# EAGLE design arpie_cv_tab (EAGLE 6.6.0)
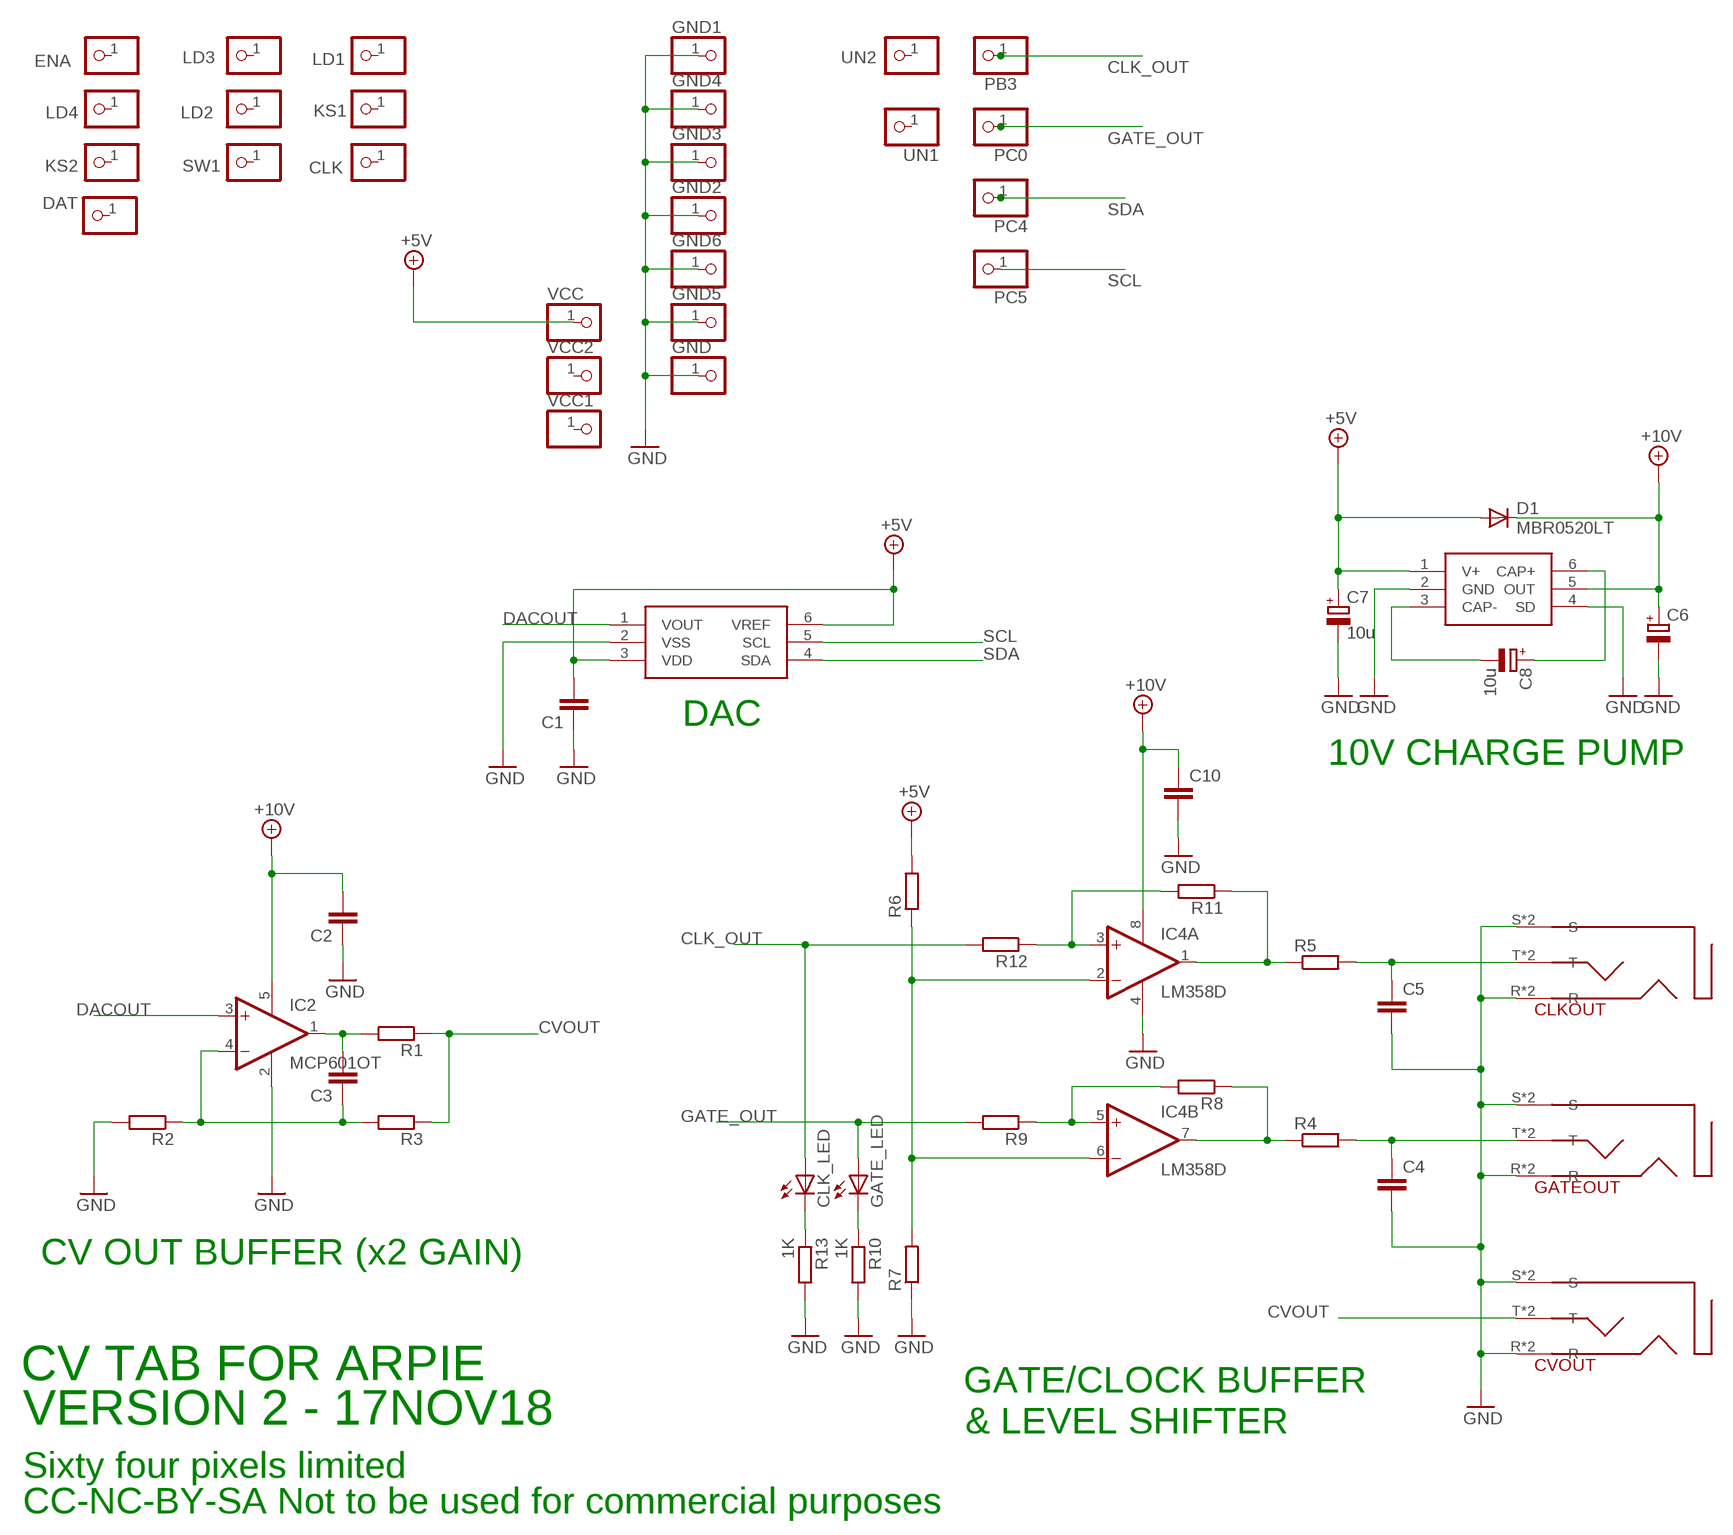
[diagram p0: schematic, sheet 1]

## Parts
C1  C-EUC0805  [C0805]
C2  C-EUC0805  [C0805]
C3  C-EUC0805  [C0805]
C4  C-EUC0805  [C0805]
C5  C-EUC0805  [C0805]
C6  CPOL-EUSMCA  [SMC_A]
C7  10u  CPOL-EUSMCA  [SMC_A]
C8  10u  CPOL-EUSMCA  [SMC_A]
C10  C-EUC0805  [C0805]
CLK  PINHD-1X1  [1X01]
CLK_LED  LED3MM  [LED3MM]
CLKOUT  SMD35MMJACK  [SMD35MMJACK]
CVOUT  SMD35MMJACK  [SMD35MMJACK]
D1  MBR0520LT  [SOD123]
DAT  PINHD-1X1  [1X01]
ENA  PINHD-1X1  [1X01]
GATE_LED  LED3MM  [LED3MM]
GATEOUT  SMD35MMJACK  [SMD35MMJACK]
GND  PINHD-1X1  [1X01]
GND1  PINHD-1X1  [1X01]
GND2  PINHD-1X1  [1X01]
GND3  PINHD-1X1  [1X01]
GND4  PINHD-1X1  [1X01]
GND5  PINHD-1X1  [1X01]
GND6  PINHD-1X1  [1X01]
IC1  MCP4726  [SOT23-6]
IC2  MCP601OT  [SOT23-5]
IC3  LM27675M5_CHARGEPUMP  [SOT23-6]
IC4  LM358D  [SO08]
KS1  PINHD-1X1  [1X01]
KS2  PINHD-1X1  [1X01]
LD1  PINHD-1X1  [1X01]
LD2  PINHD-1X1  [1X01]
LD3  PINHD-1X1  [1X01]
LD4  PINHD-1X1  [1X01]
PB3  PINHD-1X1  [1X01]
PC0  PINHD-1X1  [1X01]
PC4  PINHD-1X1  [1X01]
PC5  PINHD-1X1  [1X01]
R1  R-EU_R0805  [R0805]
R2  R-EU_R0805  [R0805]
R3  R-EU_R0805  [R0805]
R4  R-EU_R0805  [R0805]
R5  R-EU_R0805  [R0805]
R6  R-EU_R0805  [R0805]
R7  R-EU_R0805  [R0805]
R8  R-EU_R0805  [R0805]
R9  R-EU_R0805  [R0805]
R10  1K  R-EU_R0805  [R0805]
R11  R-EU_R0805  [R0805]
R12  R-EU_R0805  [R0805]
R13  1K  R-EU_R0805  [R0805]
SW1  PINHD-1X1  [1X01]
UN1  PINHD-1X1  [1X01]
UN2  PINHD-1X1  [1X01]
VCC  PINHD-1X1  [1X01]
VCC1  PINHD-1X1  [1X01]
VCC2  PINHD-1X1  [1X01]

## Nets
+5V: C1.2 C7.+ D1.A IC1.3(VDD) IC1.6(VREF) IC3.1(V+) R6.2 VCC.1
+10V: C2.2 C6.+ C10.1 D1.C IC2.5(V+) IC3.5(OUT) IC4.8(P:V+)
CLK_OUT: CLK_LED.A PB3.1 R12.2
CVOUT: CVOUT.T CVOUT.T@(T) R1.1 R3.1
DACOUT: IC1.1(VOUT) IC2.3(+IN)
GATE_OUT: GATE_LED.A PC0.1 R9.2
GND: C1.1 C2.1 C4.2 C5.2 C6.- C7.- C10.2 CLKOUT.R CLKOUT.R@(R) CLKOUT.S CLKOUT.S@(S) CVOUT.R CVOUT.R@(R) CVOUT.S CVOUT.S@(S) GATEOUT.R GATEOUT.R@(R) GATEOUT.S GATEOUT.S@(S) GND1.1 GND2.1 GND3.1 GND4.1 GND5.1 GND6.1 GND.1 IC1.2(VSS) IC2.2(V-) IC3.2(GND) IC3.4(SD) IC4.4(P:V-) R2.2 R7.1 R10.2 R13.2
N$1: IC4.2(A:-IN) IC4.6(B:-IN) R6.1 R7.2
N$2: CLK_LED.K(C) R13.1
N$3: GATE_LED.K(C) R10.1
N$4: IC4.3(A:+IN) R11.2 R12.1
N$5: IC4.5(B:+IN) R8.2 R9.1
N$9: IC4.1(A:OUT) R5.1 R11.1
N$11: C3.2 IC2.1(OUT) R1.2
N$12: IC4.7(B:OUT) R4.1 R8.1
N$15: C3.1 IC2.4(-IN) R2.1 R3.2
N$19: C5.1 CLKOUT.T CLKOUT.T@(T) R5.2
N$20: C4.1 GATEOUT.T GATEOUT.T@(T) R4.2
N$38: C8.+ IC3.6(CAP+)
N$39: C8.- IC3.3(CAP-)
SCL: IC1.5(SCL) PC5.1
SDA: IC1.4(SDA) PC4.1
Unconnected: CLK.1 DAT.1 ENA.1 KS1.1 KS2.1 LD1.1 LD2.1 LD3.1 LD4.1 SW1.1 UN1.1 UN2.1 VCC1.1 VCC2.1

## Notes on the sheet
- DAC
- 10V CHARGE PUMP
- CV OUT BUFFER (x2 GAIN)
- CV TAB FOR ARPIE
- GATE/CLOCK BUFFER
- VERSION 2 - 17NOV18 | & LEVEL SHIFTER
- Sixty four pixels limited
- CC-NC-BY-SA Not to be used for commercial purposes

## Library data of the parts
C1-C5 C10 = resistor:C-EU: CAPACITOR, European symbol
C6-C8 = rcl:CPOL-EU: POLARIZED CAPACITOR, European symbol
CLK DAT ENA GND GND1-GND6 KS1 KS2 LD1-LD4 PB3 PC0 PC4 PC5 SW1 UN1 UN2 VCC VCC1 VCC2 = adafruit:PINHD-1X1: Pin header 1x1 for 0.1" spacing With round pins
CLK_LED GATE_LED = adafruit:LED: LED OSRAM: - CHIPLED LG R971, LG N971, LY N971, LG Q971, LY Q971, LO R971, LY R971 LH N974, LH R974 LS Q976, LO Q976, LY Q976 LO Q996 - Hyper CHIPLED LW Q18S LB Q993, LB Q99A, LB R99A - SideLED LS A670, LO A670, LY A670, LG A670, LP A670 LB A673, LV A673, LT A673, LW A673 LH A674 LY A675 LS A676, LA A676, LO A676, LY A676, LW A676 LS A679, LY A679, LG A679 - Hyper Micro SIDELED® LS Y876, LA Y876, LO Y876, LY Y876 LT Y87S - SmartLED LW L88C, LW L88S LB L89C, LB L89S, LG L890 LS L89K, LO L89K, LY L89K LS L896, LA L896, LO L896, LY L896 - TOPLED LS T670, LO T670, LY T670, LG T670, LP T670 LSG T670, LSP T670, LSY T670, LOP T670, LYG T670 LG T671, LOG T671, LSG T671 LB T673, LV T673, LT T673, LW T673 LH T674 LS T676, LA T676, LO T676, LY T676, LB T676, LH T676, LSB T676, LW T676 LB T67C, LV T67C, LT T67C, LS T67K, LO T67K, LY T67K, LW E67C LS E67B, LA E67B, LO E67B, LY E67B, LB E67C, LV E67C, LT E67C LW T67C LS T679, LY T679, LG T679 LS T770, LO T770, LY T770, LG T770, LP T770 LB T773, LV T773, LT T773, LW T773 LH T774 LS E675, LA E675, LY E675, LS T675 LS T776, LA T776, LO T776, LY T776, LB T776 LHGB T686 LT T68C, LB T68C - Hyper Mini TOPLED® LB M676 - Mini TOPLED Santana® LG M470 LS M47K, LO M47K, LY M47K Source: http://www.osram.convergy.de/
CLKOUT CVOUT GATEOUT = jasons_stuff:SMD35MMJACK
D1 = diode:MBR0520LT: SCHOTTKY BARRIER RECTIFIER Source: http://onsemi.com .. MBR0520LT1-D.pdf
IC1 = jasons_stuff:MCP4726: I2C DAC 12BIT
IC2 = linear:MCP601: Single Op Amp 2.7V to 6.0V Single Supply CMOS Source: http://ww1.microchip.com/downloads/en/DeviceDoc/21314g.pdf
IC3 = jason_eagle6:LM27675M5_CHARGEPUMP
IC4 = linear:LM358: OP AMP also LM158; LM258; LM2904 Source: http://cache.national.com/ds/LM/LM158.pdf
R1-R13 = rcl:R-EU_: RESISTOR, European symbol

## Board
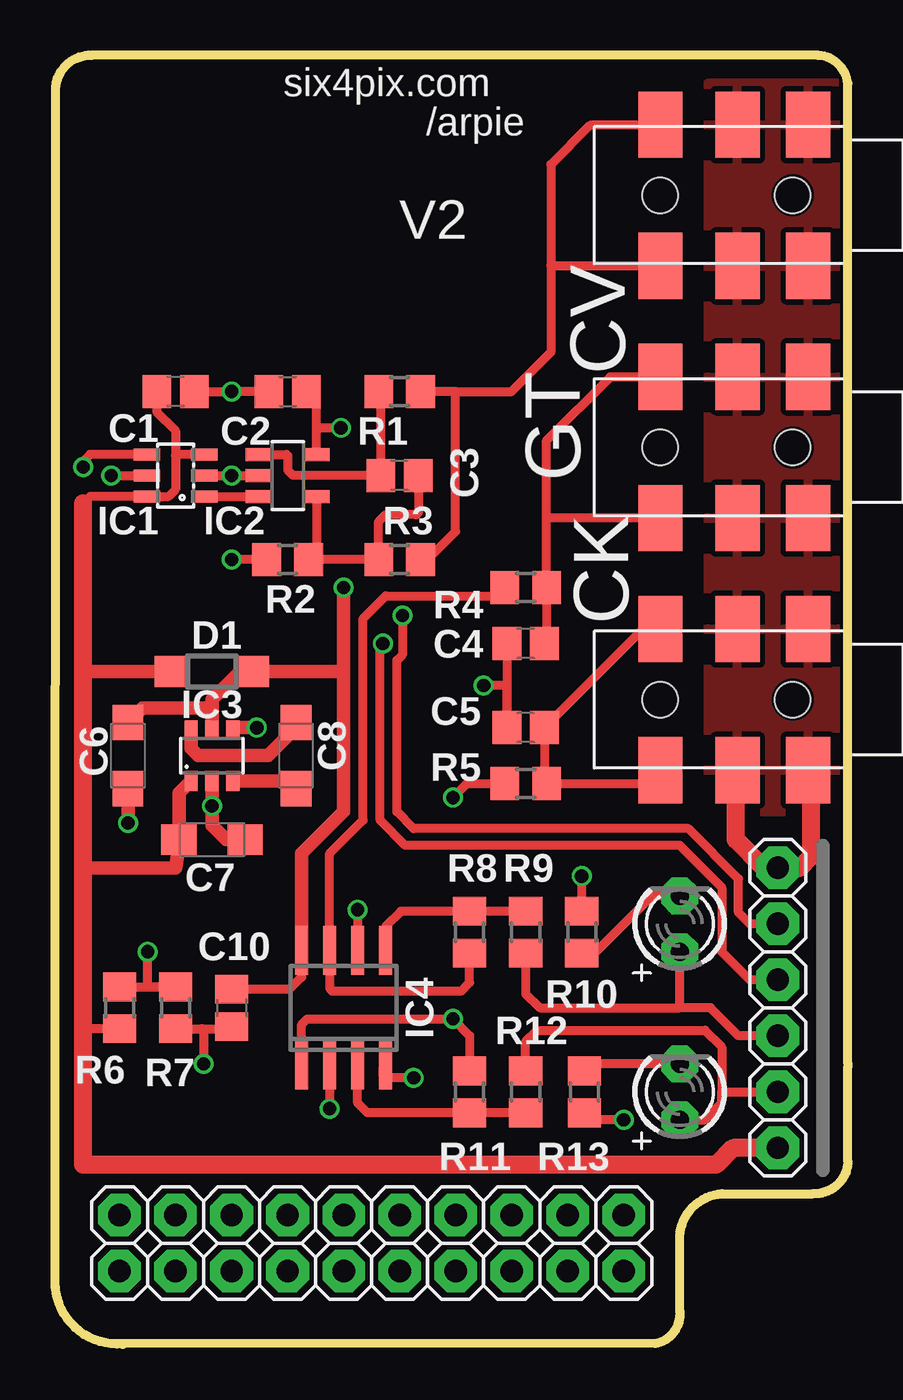
[diagram p1: board, top side]
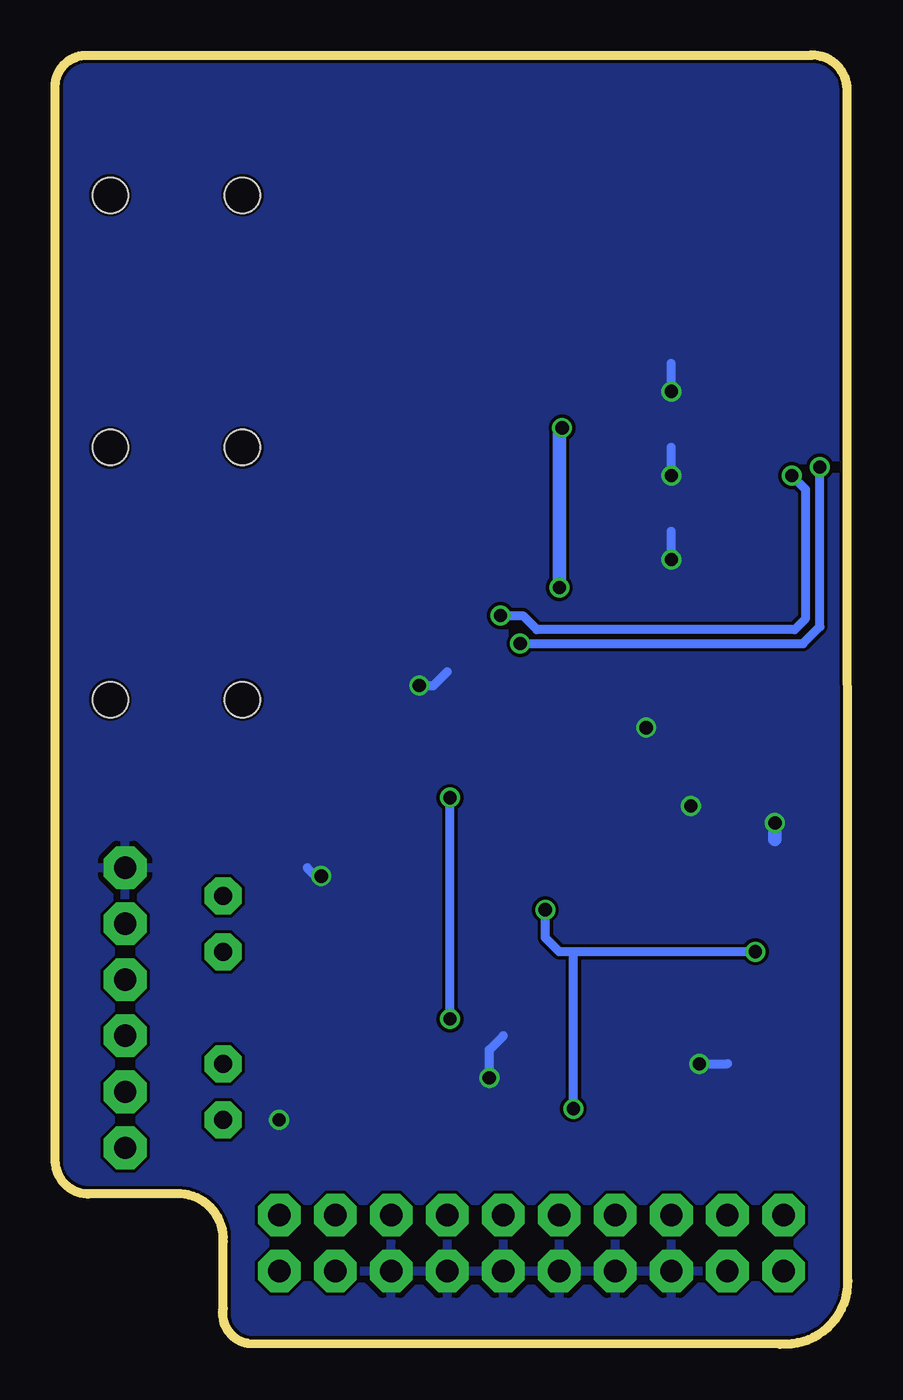
[diagram p2: board, bottom side, seen from below]

Size 35.94 x 58.44 mm. Coordinates in mm from the lower left corner, seen from the top.
Outline: 2.79,0.02 27.2,0.04 arc90 28.32,1.62 28.32,4.67 arc-90 30.25,6.82 34.37,6.82 arc90 35.94,8.27 35.94,12.59
Outline: 3.07,0 2.8,0.02 arc-90 0,2.86 0.02,56.89 arc-90 1.66,58.44
Outline: 35.94,57.15 arc81 34.6,58.44 1.65,58.44
Outline: 35.94,12.72 35.94,57.17
Copper layers (1*16): Top 0.035mm / dielectric 1.5mm / Bottom 0.035mm
Design rules "hackvana": minimum track width 6mil, minimum drill 0.3mm, track to track 6mil, track to pad 9mil, pad to pad 6mil, via to via 6mil, smd to smd 0mil, copper to edge 6mil, drill to drill 6mil, minimum pad ring 10mil, minimum via ring 6mil, stop-mask expansion 2mil, vias tented up to drill 100mil, thermal gap 10mil

### Footprints (pad centres in the part's own frame; a part is rotated, then mirrored left to right if it is on the bottom)
C0805 = smd 1.3 x 1.5: 1 -0.85,0; 2 0.85,0
SMC_A = smd 1.6 x 1.4: + -1.5,0; - 1.5,0
1X01 = drill 1.016 pad 1.93 octagon: 1 0,0
LED3MM = drill 0.813 pad 1.676 octagon: A -1.27,0; K 1.27,0
SMD35MMJACK = smd 2 x 3: R 5,3.2; R@ 5,-3.2; S 1.8,3.2; S@ 1.8,-3.2; T 8.5,3.2; T@ 8.5,-3.2 | hole 1.6: 2.5,0; 8.5,0
SOD123 = smd 1.4 x 1.4: A 1.9,0; C -1.9,0
SOT23-6 = smd 0.55 x 1.2: 1 -0.95,-1.3; 2 0,-1.3; 3 0.95,-1.3; 4 0.95,1.3; 5 0,1.3; 6 -0.95,1.3
SOT23-5 = smd 0.6 x 1.2: 1 -0.95,-1.306; 2 0,-1.306; 3 0.95,-1.306; 4 0.95,1.306; 5 -0.95,1.306
SOT23-6' = smd 0.6 x 0.9: 1 -0.95,-1.15; 2 0,-1.15; 3 0.95,-1.15; 4 0.95,1.15; 5 0,1.15; 6 -0.95,1.15
SO08 = smd 0.6 x 2.2: 1 -1.905,-2.6; 2 -0.635,-2.6; 3 0.635,-2.6; 4 1.905,-2.6; 5 1.905,2.6; 6 0.635,2.6; 7 -0.635,2.6; 8 -1.905,2.6
R0805 = smd 1.3 x 1.5: 1 -0.95,0; 2 0.95,0

### Placement (x,y rotation side)
C1  5.46,43.2 180 top
C2  10.54,43.2 0 top
C3  15.62,39.39 180 top
C4  21.34,31.77 180 top
C5  21.34,27.96 180 top
C6  3.3,26.69 270 top
C7  7.11,22.88 0 top
C8  10.92,26.69 270 top
C10  8,15.26 270 top
CLK  2.92,5.86 0 top
CLK_LED  28.32,11.45 90 top
CLKOUT  35.94,29.23 180 top
CVOUT  35.94,52.09 180 top
D1  7.11,30.5 180 top
DAT  5.46,5.86 0 top
ENA  20.7,5.86 90 top
GATE_LED  28.32,19.07 90 top
GATEOUT  35.94,40.66 180 top
GND  32.77,21.61 0 top
GND1  8,3.32 0 top
GND2  10.54,3.32 0 top
GND3  13.08,3.32 0 top
GND4  15.62,3.32 0 top
GND5  18.16,3.32 0 top
GND6  20.7,3.32 0 top
IC1  5.46,39.39 90 top
IC2  10.54,39.39 270 top
IC3  LM27675M5_CHARGEPUMP  [SOT23-6']  7.11,26.69 0 top
IC4  13.08,15.26 0 top
KS1  8,5.86 90 top
KS2  25.78,5.86 90 top
LD1  10.54,5.86 90 top
LD2  13.08,5.86 90 top
LD3  15.62,5.86 90 top
LD4  18.16,5.86 90 top
PB3  32.77,11.45 0 top
PC0  32.77,13.99 0 top
PC4  32.77,16.53 0 top
PC5  32.77,19.07 0 top
R1  15.62,43.2 180 top
R2  10.54,35.58 180 top
R3  15.62,35.58 180 top
R4  21.34,34.31 0 top
R5  21.34,25.42 0 top
R6  2.92,15.26 270 top
R7  5.46,15.26 90 top
R8  18.8,18.69 90 top
R9  21.34,18.69 270 top
R10  23.88,18.69 90 top
R11  18.8,11.45 270 top
R12  21.34,11.45 90 top
R13  24,11.45 270 top
SW1  23.24,5.86 90 top
UN1  23.24,3.32 0 top
UN2  25.78,3.32 90 top
VCC  32.77,8.91 0 top
VCC1  2.92,3.32 0 top
VCC2  5.46,3.32 0 top

### Tracks (layer width: path | path; a pad name or v marks a point on that pad's centre or on a via)
+5V
  Top 0.406: R6.2 1.59,14.31 1.27,13.99 | IC1.3 5.52,40.34 5.46,40.28 | C1.2 4.61,42.27 5.46,41.42 5.46,40.28 | 5.46,40.28 5.46,38.75 5.15,38.44 IC1.6 1.59,38.44 1.27,38.12
  Top 0.61: IC3.1 5.61,24.99 C7.+ 5.61,22.65 5.46,21.61 1.27,21.61 | D1.A 1.27,30.5
  Top 0.813: VCC.1 30.73,8.91 29.97,8.15 1.27,8.15 1.27,13.99 1.27,21.61 1.27,30.5 1.27,38.12
+10V  (via drill 0.6)
  Top 0.406: C10.1 10.63,16.11 11.18,16.65 IC4.8 | C2.2 11.81,43.2 11.85,43.16 IC2.5 11.85,41.46 11.94,41.55 v12.95,41.55
  Top 0.61: IC3.5 7.11,28.72 | 7.11,28.72 6.98,28.85 3.96,28.85 C6.+ | 7.11,28.72 7.11,29.23 8.38,30.5 D1.C 13.08,30.5 | 13.08,30.5 13.08,24.15 11.18,22.24 IC4.8 | 13.08,30.5 v13.08,34.31
  Bottom 0.61: v13.08,34.31 13.08,41.42 v12.95,41.55
CLK_OUT
  Top 0.406: R12.2 21.34,13.73 21.84,14.24 29.46,14.24 30.23,13.48 30.23,11.45 | 30.23,11.45 PB3.1 | CLK_LED.A 29.46,10.18 30.23,10.94 30.23,11.45
CVOUT
  Top 0.406: R3.1 16.89,35.58 18.16,36.85 18.16,43.2 | 16.89,43.2 R1.1 18.16,43.2 | CVOUT.T@ 27.42,55.26 24.26,55.26 22.48,53.48 22.48,48.91 | 22.48,48.91 22.48,44.98 20.7,43.2 18.16,43.2 | CVOUT.T 22.5,48.89 22.48,48.91
DACOUT
  Top 0.406: IC1.1 IC2.3
GATE_OUT
  Top 0.406: R9.2 21.34,15.89 21.97,15.26 28.32,15.26 | 28.32,15.26 GATE_LED.A | PC0.1 30.99,13.99 29.72,15.26 28.32,15.26
GND  (via drill 0.6)
  Top 0.406: C10.2 7.9,14.31 R7.1 6.66,14.31 6.73,14.24 v6.73,12.72 | 24.19,10.5 R13.2 24.32,10.18 v25.78,10.18 | C4.2 C5.2 20.49,29.82 20.45,29.86 v19.43,29.86 | R10.2 v23.88,21.23 | IC2.2 v8,39.39 IC1.2 | C1.1 v8,43.2 C2.1 | R2.2 v8,35.58 | v16.26,12.08 14.99,12.08 14.86,12.21 14.86,12.53 IC4.4
  Top 0.61: IC3.2 v7.11,24.4 7.11,23.51 7.75,22.88 C7.- 8.38,22.88 | C6.- v3.3,23.64 | v9.14,27.96 8.18,27.96 IC3.4
  Top 0.813: CLKOUT.R 30.86,25.95 30.86,22.88 32.13,21.61 GND.1 33.78,21.61 34.29,22.12 34.29,26.31 34.67,26.69
  Bottom 0.406: v6.73,12.72 5.46,12.72 | v19.43,29.86 18.8,29.86 18.16,30.5 | v23.88,21.23 23.88,20.97 24.51,21.61 | v16.26,12.08 16.26,13.35 15.62,13.99 | v8,39.39 8,40.66 | v8,43.2 8,44.47 | v8,35.58 8,36.85
  Bottom 0.61: v3.3,23.64 3.3,22.88
  pour Bottom: -2.16,64.79 -2.16,-2.52 38.48,-2.52 38.48,64.79
  pour Top: 29.59,24.15 35.94,24.15 35.94,57.17 29.59,57.17
N$1  (via drill 0.6)
  Top 0.406: R6.1 R7.2 4.26,16.21 4.19,16.27 v4.19,17.8 | IC4.2 v12.45,10.69 | v13.72,19.7 IC4.6
  Bottom 0.406: v12.45,10.69 12.45,17.8 | v4.19,17.8 12.45,17.8 | 12.45,17.8 13.08,17.8 13.72,18.43 v13.72,19.7
N$2
  Top 0.406: CLK_LED.K 24.32,12.72 R13.1
N$3
  Top 0.406: GATE_LED.K 27.05,20.34 24.51,17.8 23.94,17.8 R10.1
N$4
  Top 0.406: R12.1 R11.2 14.16,10.5 13.72,10.94 IC4.3
N$5
  Top 0.406: R9.1 R8.2 15.68,19.64 14.99,18.94 IC4.5
N$9  (via drill 0.6)
  Top 0.406: IC4.1 11.18,14.5 11.43,14.75 v18.03,14.75 18.8,13.99 R11.1 | R5.1 18.67,25.42 v18.03,24.78
  Bottom 0.406: v18.03,14.75 v18.03,24.78
N$11
  Top 0.406: R1.2 14.77,43.1 C3.2 10.79,39.39 10.54,39.64 10.54,40.28 10.48,40.34 IC2.1
N$12
  Top 0.406: R8.1 18.8,16.4 18.41,16.02 12.57,16.02 12.45,16.15 IC4.7 12.45,22.24 13.97,23.77 13.97,32.91 14.99,33.93 20.01,33.93 R4.1
N$15
  Top 0.406: IC2.4 11.85,35.93 R2.1 R3.2 14.67,37.29 14.99,37.61 16.38,37.61 16.47,37.7 C3.1
N$19
  Top 0.406: CLKOUT.T 26.83,25.42 R5.2 22.19,25.52 C5.1 26.66,32.43 CLKOUT.T@
N$20
  Top 0.406: 22.29,37.61 R4.2 22.29,31.87 C4.1 | 22.29,37.61 22.29,40.97 25.17,43.86 GATEOUT.T@ | GATEOUT.T 22.44,37.46 22.29,37.61
N$38
  Top 0.61: C8.+ 10.92,27.96 9.65,26.69 6.48,26.69 6.16,27 IC3.6
N$39
  Top 0.61: IC3.3 10.57,25.54 C8.-
SCL  (via drill 0.6)
  Top 0.406: PC5.1 31.5,19.07 30.99,19.58 30.99,21.1 28.7,23.39 16.26,23.39 15.49,24.15 15.49,31.01 15.75,31.26 v15.75,33.04 | v2.54,39.39 IC1.5
  Bottom 0.406: v2.54,39.39 1.91,38.75 1.91,32.91 2.41,32.4 14.1,32.4 14.73,33.04 v15.75,33.04
SDA  (via drill 0.6)
  Top 0.406: PC4.1 31.5,16.53 30.23,17.8 30.23,20.72 28.32,22.62 15.87,22.62 14.73,23.77 14.73,31.64 v14.86,31.77 | v1.27,39.77 1.27,40.02 1.59,40.34 IC1.4
  Bottom 0.406: v14.86,31.77 2.03,31.77 1.27,32.53 v1.27,39.77

### Text on the board
tPlace: V2 | CV | GT | CK
tNames: six4pix.com | /arpie